# Altium schematic sheet PLCC-RP2350B.SchDoc
size C; SheetNumber: 1; SheetTotal: 1
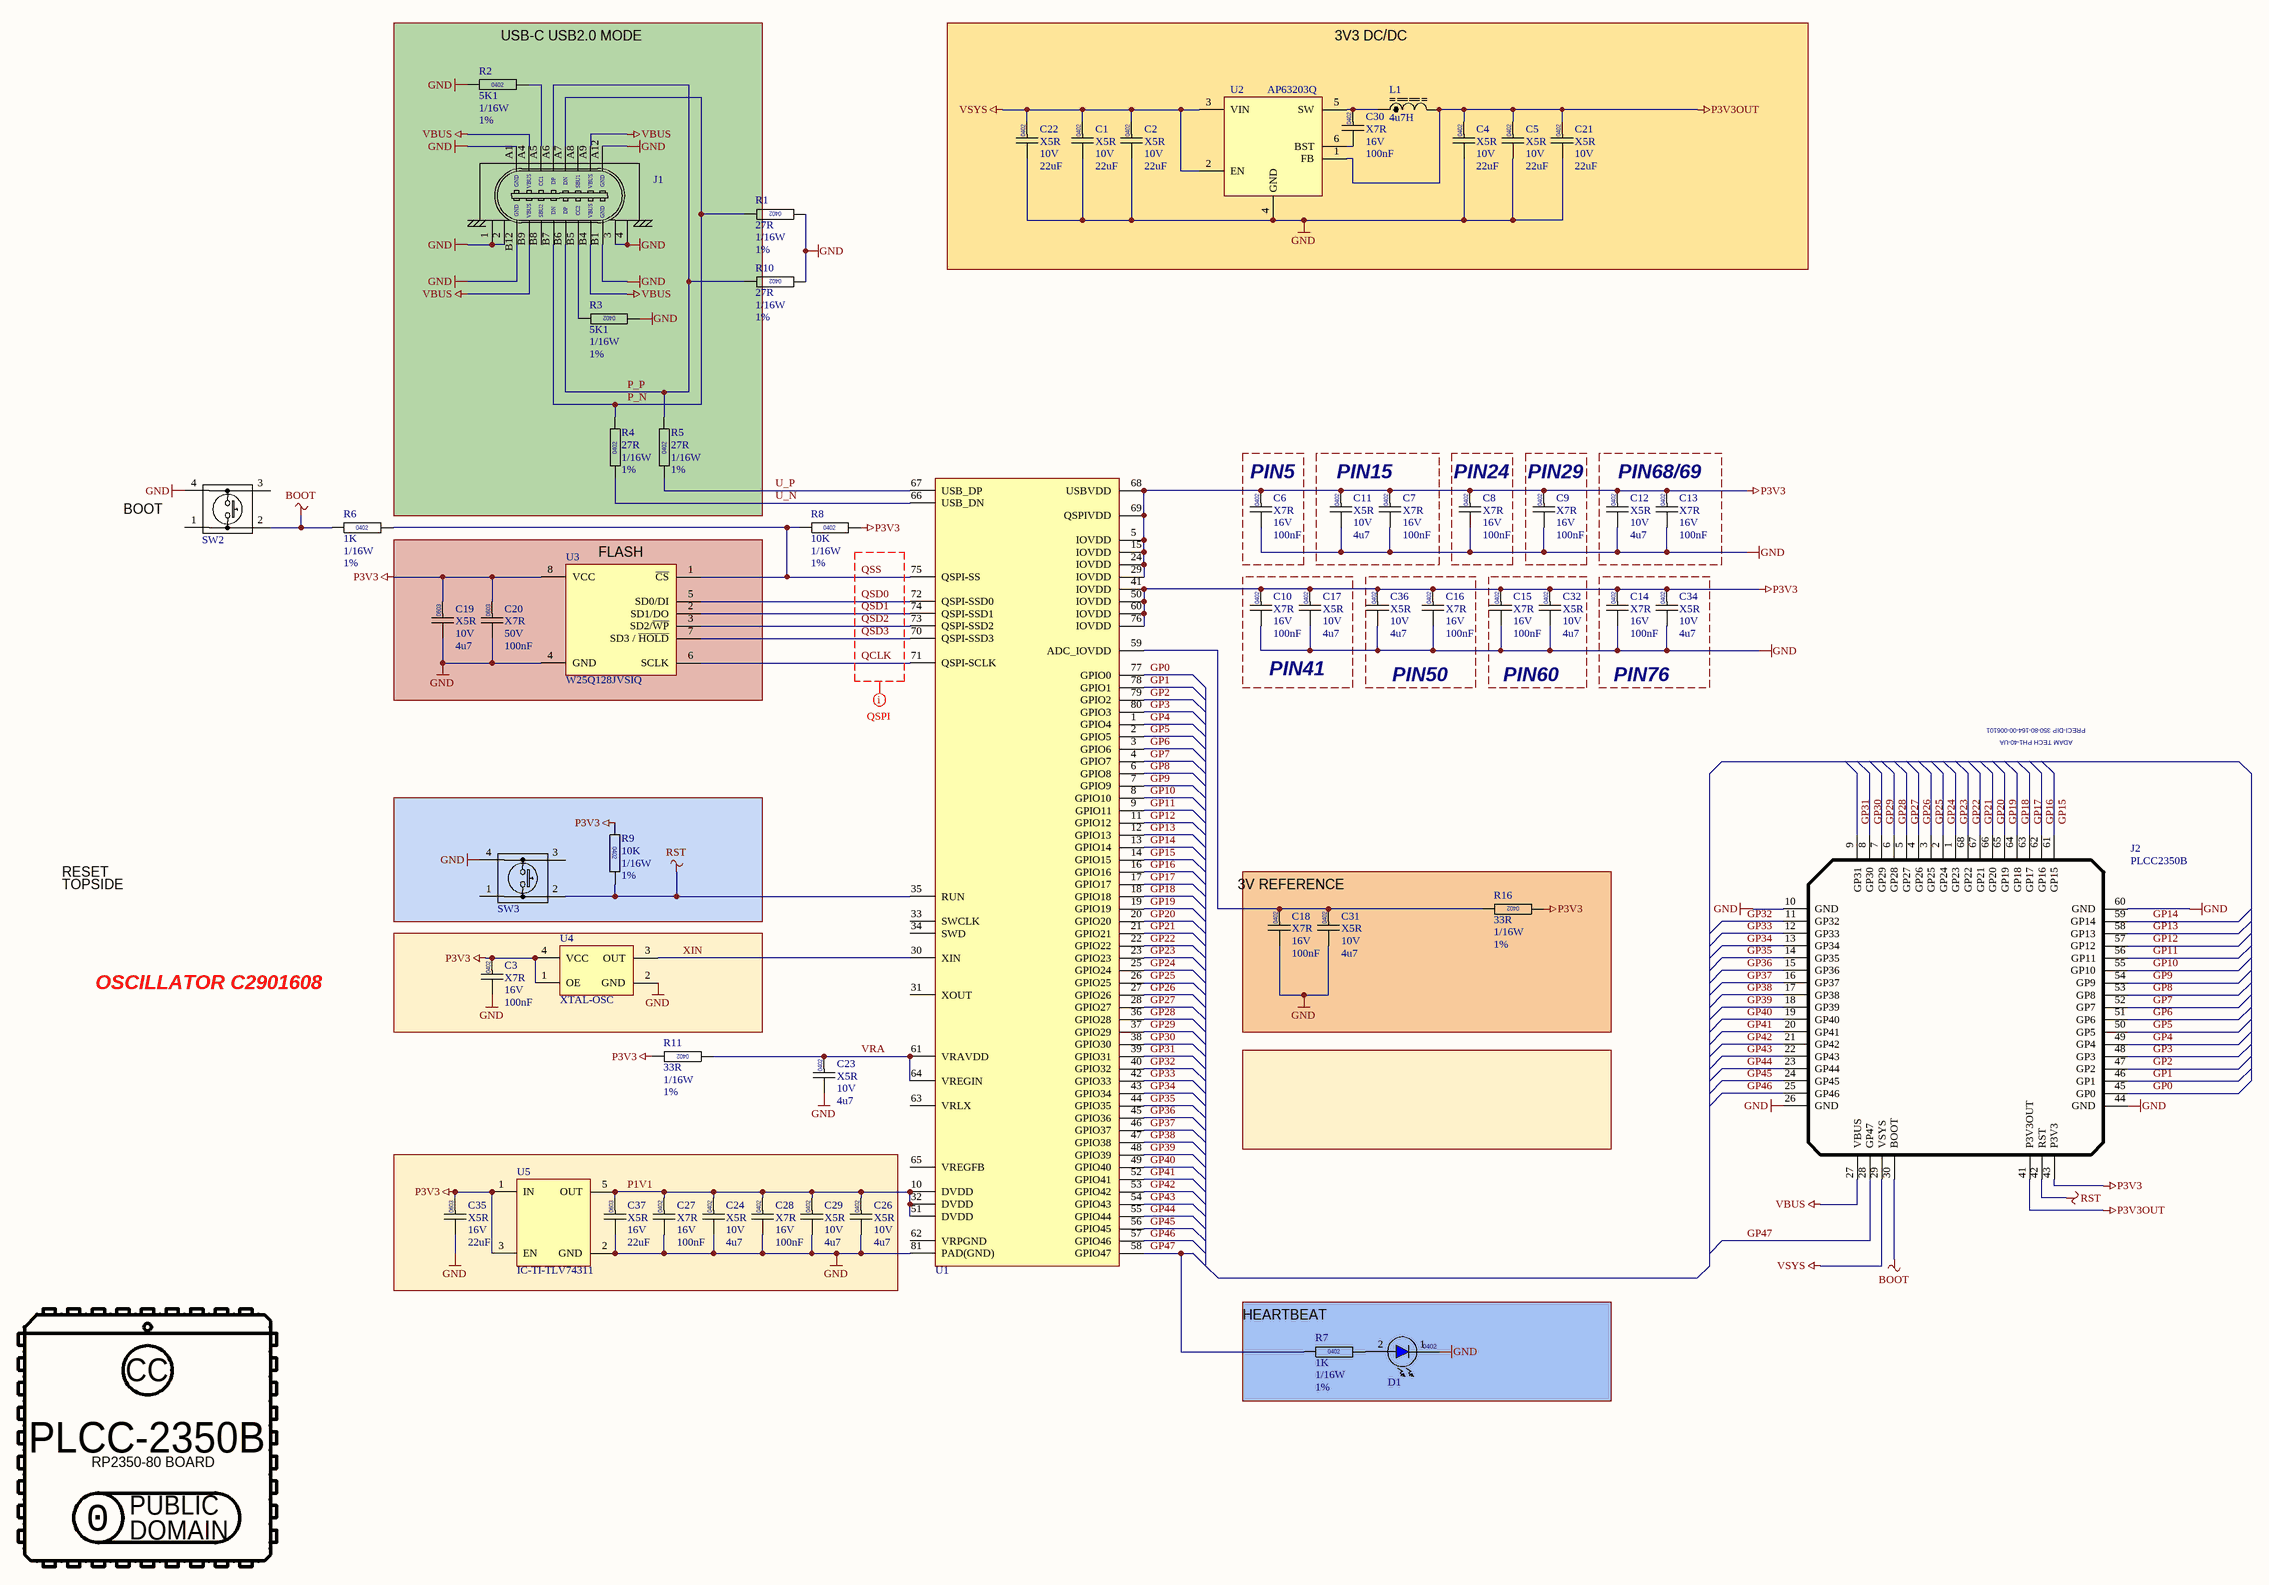
[diagram p0: PLCC-RP2350B.SchDoc]

## Parts
C1  Dielectric: X5R  Voltage: 10V  Capacitance: 22uF  [CAPC0402]  (hidden comment: CAP0402)
C2  Dielectric: X5R  Voltage: 10V  Capacitance: 22uF  [CAPC0402]  (hidden comment: CAP0402)
C3  Dielectric: X7R  Voltage: 16V  Capacitance: 100nF  [CAPC0402]  (hidden comment: CAP0402)
C4  Dielectric: X5R  Voltage: 10V  Capacitance: 22uF  [CAPC0402]  (hidden comment: CAP0402)
C5  Dielectric: X5R  Voltage: 10V  Capacitance: 22uF  [CAPC0402]  (hidden comment: CAP0402)
C6  Dielectric: X7R  Voltage: 16V  Capacitance: 100nF  [CAPC0402]  (hidden comment: CAP0402)
C7  Dielectric: X7R  Voltage: 16V  Capacitance: 100nF  [CAPC0402]  (hidden comment: CAP0402)
C8  Dielectric: X7R  Voltage: 16V  Capacitance: 100nF  [CAPC0402]  (hidden comment: CAP0402)
C9  Dielectric: X7R  Voltage: 16V  Capacitance: 100nF  [CAPC0402]  (hidden comment: CAP0402)
C10  Dielectric: X7R  Voltage: 16V  Capacitance: 100nF  [CAPC0402]  (hidden comment: CAP0402)
C11  Dielectric: X5R  Voltage: 10V  Capacitance: 4u7  [CAPC0402]  (hidden comment: CAP0402)
C12  Dielectric: X5R  Voltage: 10V  Capacitance: 4u7  [CAPC0402]  (hidden comment: CAP0402)
C13  Dielectric: X7R  Voltage: 16V  Capacitance: 100nF  [CAPC0402]  (hidden comment: CAP0402)
C14  Dielectric: X7R  Voltage: 16V  Capacitance: 100nF  [CAPC0402]  (hidden comment: CAP0402)
C15  Dielectric: X7R  Voltage: 16V  Capacitance: 100nF  [CAPC0402]  (hidden comment: CAP0402)
C16  Dielectric: X7R  Voltage: 16V  Capacitance: 100nF  [CAPC0402]  (hidden comment: CAP0402)
C17  Dielectric: X5R  Voltage: 10V  Capacitance: 4u7  [CAPC0402]  (hidden comment: CAP0402)
C18  Dielectric: X7R  Voltage: 16V  Capacitance: 100nF  [CAPC0402]  (hidden comment: CAP0402)
C19  Dielectric: X5R  Voltage: 10V  Capacitance: 4u7  [CAPC0603]  (hidden comment: CAP0603)
C20  Dielectric: X7R  Voltage: 50V  Capacitance: 100nF  [CAPC0603]  (hidden comment: CAP0603)
C21  Dielectric: X5R  Voltage: 10V  Capacitance: 22uF  [CAPC0402]  (hidden comment: CAP0402)
C22  Dielectric: X5R  Voltage: 10V  Capacitance: 22uF  [CAPC0402]  (hidden comment: CAP0402)
C23  Dielectric: X5R  Voltage: 10V  Capacitance: 4u7  [CAPC0402]  (hidden comment: CAP0402)
C24  Dielectric: X5R  Voltage: 10V  Capacitance: 4u7  [CAPC0402]  (hidden comment: CAP0402)
C26  Dielectric: X5R  Voltage: 10V  Capacitance: 4u7  [CAPC0402]  (hidden comment: CAP0402)
C27  Dielectric: X7R  Voltage: 16V  Capacitance: 100nF  [CAPC0402]  (hidden comment: CAP0402)
C28  Dielectric: X7R  Voltage: 16V  Capacitance: 100nF  [CAPC0402]  (hidden comment: CAP0402)
C29  Dielectric: X5R  Voltage: 10V  Capacitance: 4u7  [CAPC0402]  (hidden comment: CAP0402)
C30  Dielectric: X7R  Voltage: 16V  Capacitance: 100nF  [CAPC0402]  (hidden comment: CAP0402)
C31  Dielectric: X5R  Voltage: 10V  Capacitance: 4u7  [CAPC0402]  (hidden comment: CAP0402)
C32  Dielectric: X5R  Voltage: 10V  Capacitance: 4u7  [CAPC0402]  (hidden comment: CAP0402)
C34  Dielectric: X5R  Voltage: 10V  Capacitance: 4u7  [CAPC0402]  (hidden comment: CAP0402)
C35  Dielectric: X5R  Voltage: 16V  Capacitance: 22uF  [CAPC0603]  (hidden comment: CAP0603)
C36  Dielectric: X5R  Voltage: 10V  Capacitance: 4u7  [CAPC0402]  (hidden comment: CAP0402)
C37  Dielectric: X5R  Voltage: 16V  Capacitance: 22uF  [CAPC0603]  (hidden comment: CAP0603)
D1  LED-0402-BLUE  [LED-0402-BLUE]  (value not drawn)
J1  CONN-USBC-USB2-HOR  [CONN-GCT-USB4085]  (value not drawn)
J2  PLCC2350B  [PLCC2350B]
L1  value 4u7H  [IND-ABRACON-ASPI-3012S-3R9N-T]  (hidden comment: 4.7uH)
LOGO1  LOGO-LICENSE-CC0-PUBLIC  [LOGO-LICENSE-CC0-PUBLIC]  (value not drawn)  (no BOM)
LOGO2  LOGO-LICENSE-CC  [LOGO-LICENSE-CC]  (value not drawn)  (no BOM)
R1  value 27R  Power: 1/16W  Tolerance: 1%  [RESC0402]  (hidden comment: RESC0402)
R2  value 5K1  Power: 1/16W  Tolerance: 1%  [RESC0402]  (hidden comment: RESC0402)
R3  value 5K1  Power: 1/16W  Tolerance: 1%  [RESC0402]  (hidden comment: RESC0402)
R4  value 27R  Power: 1/16W  Tolerance: 1%  [RESC0402]  (hidden comment: RESC0402)
R5  value 27R  Power: 1/16W  Tolerance: 1%  [RESC0402]  (hidden comment: RESC0402)
R6  value 1K  Power: 1/16W  Tolerance: 1%  [RESC0402]  (hidden comment: RESC0402)
R7  value 1K  Power: 1/16W  Tolerance: 1%  [RESC0402]  (hidden comment: RESC0402)
R8  value 10K  Power: 1/16W  Tolerance: 1%  [RESC0402]  (hidden comment: RESC0402)
R9  value 10K  Power: 1/16W  Tolerance: 1%  [RESC0402]  (hidden comment: RESC0402)
R10  value 27R  Power: 1/16W  Tolerance: 1%  [RESC0402]  (hidden comment: RESC0402)
R11  value 33R  Power: 1/16W  Tolerance: 1%  [RESC0402]  (hidden comment: RESC0402)
R16  value 33R  Power: 1/16W  Tolerance: 1%  [RESC0402]  (hidden comment: RESC0402)
SW2  SWITCH-PANASONIC-EVP-AA202K  [SWITCH-PANASONIC-EVP-AA202K]  (value not drawn)
SW3  SWITCH-PANASONIC-EVP-AA202K  [SWITCH-PANASONIC-EVP-AA202K]  (value not drawn)
U1  IC-RP2350-DIP64  [QFN40P1000X1000X90_HS-81N]  (value not drawn)
U2  AP63203Q  [SOT23-6]
U3  W25Q128JVSIQ  [SO127P790-8N]
U4  XTAL-OSC  [XOSC-SCTF-SX1M12.000M10F30TNN]
U5  IC-TI-TLV74311  [SOT23-5]

## Blocks framed on the sheet
USB-C USB2.0 MODE: J1 R2-R5
3V3 DC/DC: C1 C2 C4 C5 C21 C22 C30 L1 U2
PIN5: C6
PIN15: C7 C11
PIN24: C8
PIN29: C9
PIN68/69: C12 C13
FLASH: C19 C20 U3
PIN41: C10 C17
PIN50: C16 C36
PIN60: C15 C32
PIN76: C14 C34
3V REFERENCE: C18 C31 R16
HEARTBEAT: D1 R7

## Nets
BOOT: J2.30(BOOT) R6.1 SW2.2
GND: C1.2 C2.2 C3.2 C4.2 C5.2 C6.2 C7.2 C8.2 C9.2 C10.2 C11.2 C12.2 C13.2 C14.2 C15.2 C16.2 C17.2 C18.2 C19.2 C20.2 C21.2 C22.2 C23.2 C24.2 C26.2 C27.2 C28.2 C29.2 C31.2 C32.2 C34.2 C35.2 C36.2 C37.2 D1.1(A) J1.1 J1.2 J1.3 J1.4 J1.A1 J1.A12 J1.B1 J1.B12 J2.10(GND) J2.26(GND) J2.44(GND) J2.60(GND) R1.2 R2.2 R3.2 R10.2 SW2.4 SW3.4 U1.81(PAD(GND)) U2.4(GND) U3.4(GND) U4.2(GND) U5.2(GND)
P3V3: C3.1 C6.1 C7.1 C8.1 C9.1 C10.1 C11.1 C12.1 C13.1 C14.1 C15.1 C16.1 C17.1 C19.1 C20.1 C32.1 C34.1 C35.1 C36.1 J2.43(P3V3) R8.2 R9.2 R11.1 R16.2 U1.5(IOVDD) U1.15(IOVDD) U1.24(IOVDD) U1.29(IOVDD) U1.41(IOVDD) U1.50(IOVDD) U1.60(IOVDD) U1.68(USBVDD) U1.69(QSPIVDD) U1.76(IOVDD) U3.8(VCC) U4.1(OE) U4.4(VCC) U5.1(IN) U5.3(EN)
P3V3OUT: C4.1 C5.1 C21.1 J2.41(P3V3OUT) L1.2 U2.1(FB)
RST: J2.42(RST) R9.1 SW3.2 U1.35(RUN)
VBUS: J1.A4 J1.A9 J1.B4 J1.B9 J2.27(VBUS)
VSYS: C1.1 C2.1 C22.1 J2.29(VSYS) U2.2(EN) U2.3(VIN)
GP0: J2.45(GP0) U1.77(GPIO0)
GP1: J2.46(GP1) U1.78(GPIO1)
GP2: J2.47(GP2) U1.79(GPIO2)
GP3: J2.48(GP3) U1.80(GPIO3)
GP4: J2.49(GP4) U1.1(GPIO4)
GP5: J2.50(GP5) U1.2(GPIO5)
GP6: J2.51(GP6) U1.3(GPIO6)
GP7: J2.52(GP7) U1.4(GPIO7)
GP8: J2.53(GP8) U1.6(GPIO8)
GP9: J2.54(GP9) U1.7(GPIO9)
GP10: J2.55(GP10) U1.8(GPIO10)
GP11: J2.56(GP11) U1.9(GPIO11)
GP12: J2.57(GP12) U1.11(GPIO12)
GP13: J2.58(GP13) U1.12(GPIO13)
GP14: J2.59(GP14) U1.13(GPIO14)
GP15: J2.61(GP15) U1.14(GPIO15)
GP16: J2.62(GP16) U1.16(GPIO16)
GP17: J2.63(GP17) U1.17(GPIO17)
GP18: J2.64(GP18) U1.18(GPIO18)
GP19: J2.65(GP19) U1.19(GPIO19)
GP20: J2.66(GP20) U1.20(GPIO20)
GP21: J2.67(GP21) U1.21(GPIO21)
GP22: J2.68(GP22) U1.22(GPIO22)
GP23: J2.1(GP23) U1.23(GPIO23)
GP24: J2.2(GP24) U1.25(GPIO24)
GP25: J2.3(GP25) U1.26(GPIO25)
GP26: J2.4(GP26) U1.27(GPIO26)
GP27: J2.5(GP27) U1.28(GPIO27)
GP28: J2.6(GP28) U1.36(GPIO28)
GP29: J2.7(GP29) U1.37(GPIO29)
GP30: J2.8(GP30) U1.38(GPIO30)
GP31: J2.9(GP31) U1.39(GPIO31)
GP32: J2.11(GP32) U1.40(GPIO32)
GP33: J2.12(GP33) U1.42(GPIO33)
GP34: J2.13(GP34) U1.43(GPIO34)
GP35: J2.14(GP35) U1.44(GPIO35)
GP36: J2.15(GP36) U1.45(GPIO36)
GP37: J2.16(GP37) U1.46(GPIO37)
GP38: J2.17(GP38) U1.47(GPIO38)
GP39: J2.18(GP39) U1.48(GPIO39)
GP40: J2.19(GP40) U1.49(GPIO40)
GP41: J2.20(GP41) U1.52(GPIO41)
GP42: J2.21(GP42) U1.53(GPIO42)
GP43: J2.22(GP43) U1.54(GPIO43)
GP44: J2.23(GP44) U1.55(GPIO44)
GP45: J2.24(GP45) U1.56(GPIO45)
GP46: J2.25(GP46) U1.57(GPIO46)
GP47: J2.28(GP47) R7.1 U1.58(GPIO47)
P1V1: C24.1 C26.1 C27.1 C28.1 C29.1 C37.1 U1.10(DVDD) U1.32(DVDD) U1.51(DVDD) U5.5(OUT)
P_N: J1.A7 J1.B7 R1.1 R4.1
P_P: J1.A6 J1.B6 R5.1 R10.1
QCLK: U1.71(QSPI-SCLK) U3.6(SCLK)
QSD0: U1.72(QSPI-SSD0) U3.5(SD0/DI)
QSD1: U1.74(QSPI-SSD1) U3.2(SD1/DO)
QSD2: U1.73(QSPI-SSD2) U3.3(SD2/~{WP})
QSD3: U1.70(QSPI-SSD3) U3.7(SD3_/_~{HOLD})
QSS: R6.2 R8.1 U1.75(QSPI-SS) U3.1(~{CS})
U_N: R4.2 U1.66(USB_DN)
U_P: R5.2 U1.67(USB_DP)
VRA: C23.1 R11.2 U1.61(VRAVDD) U1.64(VREGIN)
XIN: U1.30(XIN) U4.3(OUT)
NetC18_1: C18.1 C31.1 R16.1 U1.59(ADC_IOVDD)
NetC30_1: C30.1 L1.1 U2.5(SW)
NetC30_2: C30.2 U2.6(BST)
NetD1_2: D1.2(K) R7.2
NetJ1_A5: J1.A5 R2.1
NetJ1_B5: J1.B5 R3.1

Not connected (* = marked no-connect by the designer): J1 A8 B8; SW2 1 3; SW3 1 3; U1 31(XOUT) 33(SWCLK) 34(SWD) 62(VRPGND) 63(VRLX) 65(VREGFB)

## Layout directives
net class QSPI; rule Matched Net Lengths [Delay Tolerance = 50ps]; rule Length Constraint [Min Delay = 0ps    Max Delay = 500ps]: QCLK, QSD0, QSD1, QSD2, QSD3, QSS

## Notes on the sheet
- BOOT
- PRECI-DIP 350-80-164-00-006101
- ADAM TECH PH1-40-UA
- RESET
- TOPSIDE
- OSCILLATOR C2901608
- PLCC-2350B
- (near LOGO1) RP2350-80 BOARD
- (in symbol CAPC-0402-4u7-10V-X5R) 0402
- (in symbol CONN-USBC-USB2-HOR) GND; VBUS; CC1; DP; DN; SBU1; SBU2; CC2
- (in symbol LED-0402-BLUE) 0402
- (in symbol LOGO-LICENSE-CC) CC
- (in symbol LOGO-LICENSE-CC0-PUBLIC) PUBLIC; 0; DOMAIN
- (in symbol RESC-0402-1K-1%-1/10W) 0402
- (in symbol RESC-0402-5K1-1%-1/10W) 0402
- (in symbol RESC-0402-10K-1%-1/10W) 0402
- (in symbol RESC-0402-27R-1%-1/10W) 0402
- (in symbol RESC-0402-33R-1%-1/10W) 0402

## Library data of the parts
C1 C2 C4 C5 C21 C22 = CAPC-0402-22uF-10V-X5R: CAPACITOR,CERAMIC,22uF,10V,X5R,0402; Manufacturer 1: SAMSUNG; Package / Case: 0402; Location: *; Supplier 1: Digikey; Supplier Part Number 1: 1276-1482-1-ND; LCSC: C6119813
C3 C6-C10 C13-C16 C18 C27 C28 C30 = CAPC-0402-100nF-16V-X7R: CAPACITOR,CERAMIC,100nF,16V,X7R,0402; Package / Case: 0402; Location: *; Supplier 1: Digikey; Supplier Part Number 1: 1292-1630-1-ND; LCSC: C60474
C11 C12 C17 C23 C24 C26 C29 C31 C32 C34 C36 = CAPC-0402-4u7-10V-X5R: CAPACITOR,CERAMIC,4u7,10V,X5R,0402; Package / Case: 0603; Location: *; Supplier 1: Digikey; Supplier Part Number 1: 1276-1482-1-ND; LCSC: C1705
C19 = CAPC-0603-4u7-10V-X5R: CAPACITOR,CERAMIC,4u7,10V,X5R,0603; Manufacturer 1: SAMSUNG; Manufacturer Part Number 1: CL10A475KP8NNNC; Package / Case: 0603; Location: *; Supplier 1: Arrow Electronics; Supplier Part Number 1: GRM188Z71A475KE15J; LCSC: C1705; MOUSER: 187-CL10A475KP8NNNC
C20 = CAPC-0603-100nF-50V-X7R: CAPACITOR,CERAMIC,100nF,50V,X7R,0603; Manufacturer 1: KEMET; Manufacturer Part Number 1: C0603C104K5RACTU; Package / Case: 0603; Location: *; LCSC: C14663; MOUSER: 80-C0603C104K5R
C35 C37 = CAPC-0603-22uF-16V-X5R: CAPACITOR,CERAMIC,22uF,16V,X5R,0603; Manufacturer 1: SAMSUNG; Manufacturer Part Number 1: CL10A226MO7JZNC; Package / Case: 0603; Location: *; Supplier 1: Digikey; Supplier Part Number 1: 1276-7076-1-ND; LCSC: C2762594; MOUSER: 187-CL10A226MO7JZNC
D1 = LED-0402-BLUE: LED,SMD,BLUE,90mCd,0603; Manufacturer 1: Yongyu Photoelectric; Manufacturer Part Number 1: SZYY0402B; LCSC: C434447
J1 = CONN-USBC-USB2-HOR: CONN,USB-C,16P,RA,TH,8.94X9.17; Supplier 1: Digikey; Supplier Part Number 1: 2073-USB4085-GF-ACT-ND; LCSC: C36936564
L1 = IND-TAIYO-NRH3012T4R7MN: IND,4.7uH,1.06A,3X3, NRH3012T4R7MN; LCSC: C5159666; Supplier 1: Digikey; Supplier Part Number 1: 587-2591-1-ND
R1 R4 R5 R10 = RESC-0402-27R-1%-1/10W: RESISTOR,27R,1%,63mW,0402 (1005); Location: *; Supplier 1: Future Electronics; Supplier Part Number 1: 2577120; LCSC: C138021
R2 R3 = RESC-0402-5K1-1%-1/10W: RESISTOR,5K1,1%,63mW,0402 (1005); Location: *; LCSC: C105872; Supplier 1: Future Electronics; Supplier Part Number 1: 6053649
R6 R7 = RESC-0402-1K-1%-1/10W: RESISTOR,1K,1%,63mW,0402 (1005); Location: *; LCSC: C106235; Supplier 1: Future Electronics; Supplier Part Number 1: 7825607
R8 R9 = RESC-0402-10K-1%-1/10W: RESISTOR,10K,1%,63mW,0402 (1005); Location: *; LCSC: C60490; Supplier 1: Future Electronics; Supplier Part Number 1: 3388022
R11 R16 = RESC-0402-33R-1%-1/10W: RESISTOR,33R,1%,63mW,0402 (1005); Location: *; LCSC: C138002; Supplier 1: Future Electronics; Supplier Part Number 1: 8177883
SW2 SW3 = SWITCH-PANASONIC-EVP-AA202K: SW,SMD,TACT,4PIN,2.9X3.5,4PIN; Supplier 1: Mouser; Supplier Part Number 1: 667-EVP-AA202K; LCSC: C483888
U1 = IC-RP2350-DIP64: IC,CPU,RP2350B,QFN80; LCSC: C42415655
U2 = IC-DIODES-AP63203Q: IC,PMIC,STEP-DOWN, 2A 3.3V; Supplier 1: Digikey; Supplier Part Number 1: 31-AP63203QWU-7CT-ND; LCSC: C780769
U3 = IC-WINBOND-W25Q128JVSIQ: IC,FLASH,QSPI,16Mx8; Supplier 1: Digikey; Supplier Part Number 1: W25Q128JVSIQCT-ND; LCSC: C97521